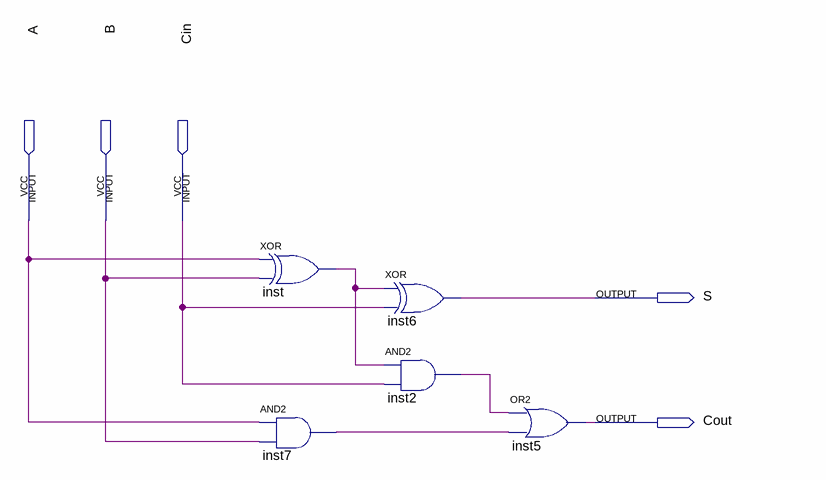
[diagram p0: schematic sheet]
// Quartus schematic FullAdder.bdf as structural Verilog: 5 symbols, 5 pins
module FullAdder (
  input  A,
  input  B,
  input  Cin,
  output S,
  output Cout
);

  wire inst2_out, inst7_out, inst_out;

  xor inst (inst_out, A, B);
  and inst7 (inst7_out, A, B);
  xor inst6 (S, inst_out, Cin);
  and inst2 (inst2_out, inst_out, Cin);
  or inst5 (Cout, inst2_out, inst7_out);
endmodule
